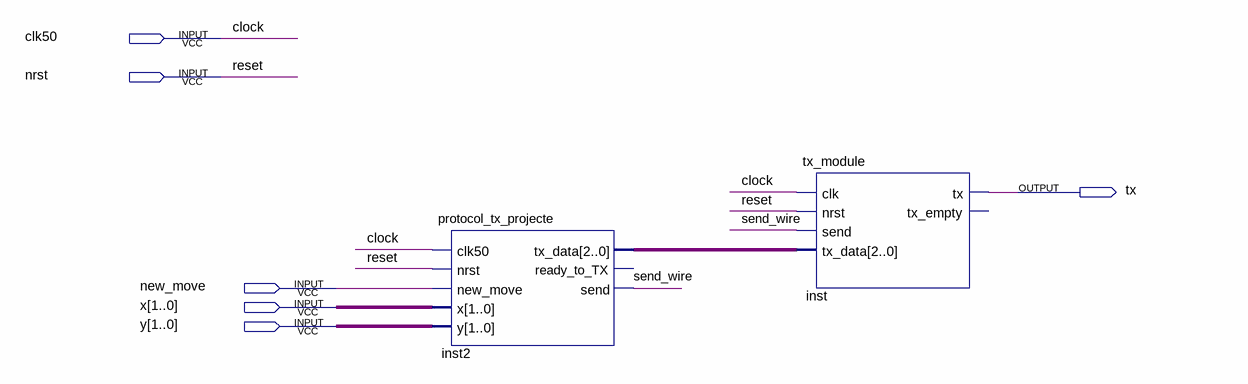
[diagram p0: schematic sheet]
// Quartus schematic transmision.bdf as structural Verilog: 2 symbols, 6 pins
module transmision (
  input  clk50,
  input  nrst,
  input  new_move,
  input  [1:0] x,
  input  [1:0] y,
  output tx
);

  wire send_wire;
  wire [2:0] inst2_tx_data;

  protocol_tx_projecte inst2 (
    .clk50(clk50), .nrst(nrst), .new_move(new_move), .x(x), .y(y), .tx_data(inst2_tx_data), .send(send_wire));  // open: ready_to_TX
  tx_module inst (.clk(clk50), .nrst(nrst), .send(send_wire), .tx_data(inst2_tx_data), .tx(tx));  // open: tx_empty

  // Other names for the same wires on the sheet: clock = clk50; reset = nrst
endmodule
